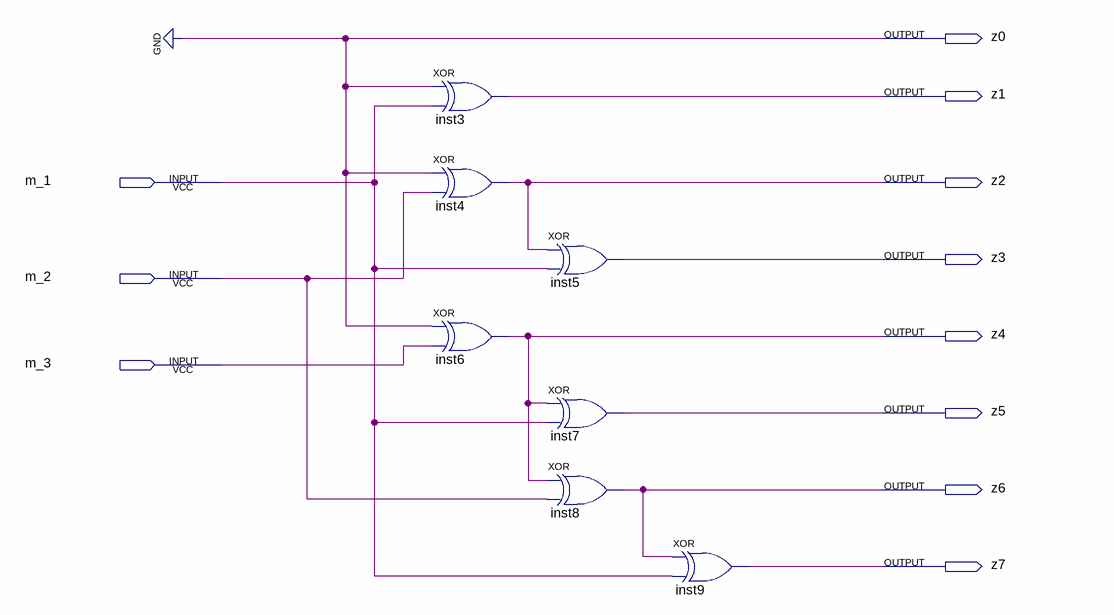
[diagram p0: schematic sheet]
// Quartus schematic partial_encoder.bdf as structural Verilog: 7 symbols, 11 pins
module partial_encoder (
  input  m_1,
  input  m_2,
  input  m_3,
  output z0,
  output z1,
  output z2,
  output z3,
  output z4,
  output z5,
  output z6,
  output z7
);

  xor inst3 (z1, 1'b0, m_1);
  xor inst4 (z2, 1'b0, m_2);
  xor inst6 (z4, 1'b0, m_3);
  xor inst5 (z3, z2, m_1);
  xor inst7 (z5, z4, m_1);
  xor inst8 (z6, z4, m_2);
  xor inst9 (z7, z6, m_1);

  assign z0 = 1'b0;
endmodule
